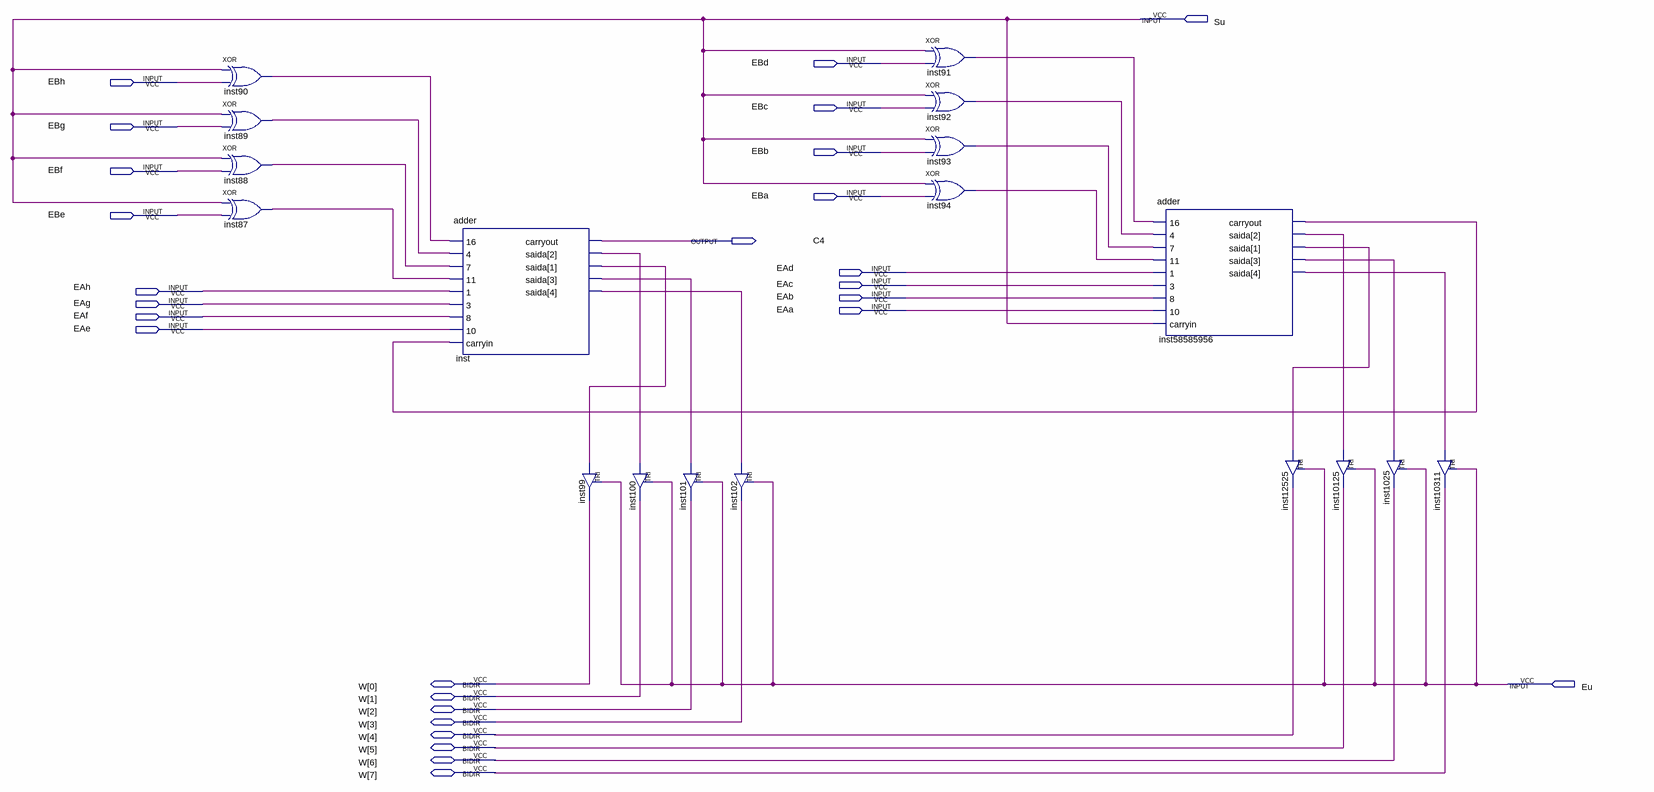
[diagram p0: schematic sheet]
// Quartus schematic adder_sub.bdf as structural Verilog: 18 symbols, 27 pins
module adder_sub (
  input  Su,
  input  EBd,
  input  EBh,
  input  EBc,
  input  EBg,
  input  EBb,
  input  EBf,
  input  EBa,
  input  EBe,
  input  EAd,
  input  EAc,
  input  EAh,
  input  EAb,
  input  EAg,
  input  EAa,
  input  EAf,
  input  EAe,
  input  Eu,
  inout  [7:0] W,
  output C4
);

  wire inst87_out, inst88_out, inst89_out, inst90_out, inst91_out, inst92_out, inst93_out, inst94_out,
       inst58585956_carryout, inst58585956_saida, inst58585956_saida_2, inst58585956_saida_3,
       inst58585956_saida_4, inst_saida, inst_saida_2, inst_saida_3, inst_saida_4;

  xor inst90 (inst90_out, Su, EBh);
  xor inst89 (inst89_out, Su, EBg);
  xor inst88 (inst88_out, Su, EBf);
  xor inst87 (inst87_out, Su, EBe);
  adder inst (
    .\16 (inst90_out), .\4 (inst89_out), .\7 (inst88_out), .\11 (inst87_out), .\1 (EAh), .\3 (EAg),
    .\8 (EAf), .\10 (EAe), .carryin(inst58585956_carryout), .carryout(C4),
    .saida({inst_saida_3, inst_saida_2, inst_saida, inst_saida_4}));
  TRI inst99 (.IN(inst_saida_4), .OE(Eu), .OUT(W[0]));
  TRI inst100 (.IN(inst_saida), .OE(Eu), .OUT(W[1]));
  TRI inst101 (.IN(inst_saida_2), .OE(Eu), .OUT(W[2]));
  TRI inst102 (.IN(inst_saida_3), .OE(Eu), .OUT(W[3]));
  xor inst91 (inst91_out, Su, EBd);
  xor inst92 (inst92_out, Su, EBc);
  xor inst93 (inst93_out, Su, EBb);
  xor inst94 (inst94_out, Su, EBa);
  adder inst58585956 (
    .\16 (inst91_out), .\4 (inst92_out), .\7 (inst93_out), .\11 (inst94_out), .\1 (EAd), .\3 (EAc),
    .\8 (EAb), .\10 (EAa), .carryin(Su), .carryout(inst58585956_carryout),
    .saida({inst58585956_saida_2, inst58585956_saida_3, inst58585956_saida, inst58585956_saida_4}));
  TRI inst12525 (.IN(inst58585956_saida_4), .OE(Eu), .OUT(W[4]));
  TRI inst10125 (.IN(inst58585956_saida), .OE(Eu), .OUT(W[5]));
  TRI inst1025 (.IN(inst58585956_saida_3), .OE(Eu), .OUT(W[6]));
  TRI inst10311 (.IN(inst58585956_saida_2), .OE(Eu), .OUT(W[7]));
endmodule
